# Altium schematic sheet sensors.SchDoc
size A4; DocumentNumber: 3; SheetNumber: 3; SheetTotal: 4
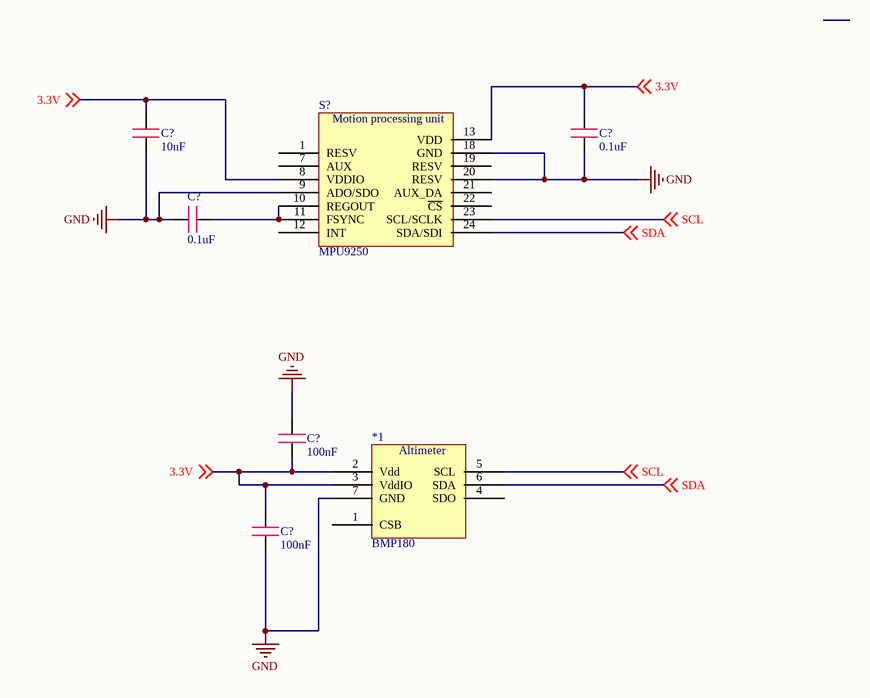
[diagram p0: sensors.SchDoc]

## Parts
(Parts that share a designator on the sheet are numbered #1, #2 ... from top to bottom, then left to right.)
*1  BMP180  [LGA7-1.5-3.8X3.6MM]
C?#1  value 10nF  [C0402]  (hidden comment: Capacity)
C?#2  value 0.1uF  [C0402]  (hidden comment: Capacity)
C?#3  value 0.1uF  [C0402]  (hidden comment: Capacity)
C?#4  value 100nF  [C0402]  (hidden comment: Capacity)
C?#5  value 100nF  [C0402]  (hidden comment: Capacity)
S?  MPU9250  [QFN40P300X300X100_HS-25N]

## Nets
GND: *1.7(GND) C?#1.2 C?#2.2 C?#3.2 C?#4.1 C?#5.2 S?.9(ADO/SDO) S?.18(GND) S?.20(RESV)
3.3V: *1.2(Vdd) *1.3(VddIO) C?#1.1 C?#2.1 C?#4.2 C?#5.1 S?.8(VDDIO) S?.13(VDD) ; off-sheet 3.3V
SCL: *1.5(SCL) S?.23(SCL/SCLK) ; off-sheet SCL
SDA: *1.6(SDA) S?.24(SDA/SDI) ; off-sheet SDA
NetC?#3_1: C?#3.1 S?.10(REGOUT) S?.11(FSYNC)

Not connected (* = marked no-connect by the designer): *1 1(CSB) 4(SDO); S? 1(RESV) 2(NC) 3(NC) 4(NC) 5(NC) 6(NC) 7(AUX) 12(INT) 14(NC) 15(NC) 16(NC) 17(NC) 19(RESV) 21(AUX_DA) 22(~{CS})

## Notes on the sheet
- (in symbol BMP180) Altimeter
- (in symbol MPU9250) Motion processing unit

## Library data of the parts
*1 = BMP180: Bosch Digital Pressure Sensor
S? = MPU9250: Motion processing unit sensor